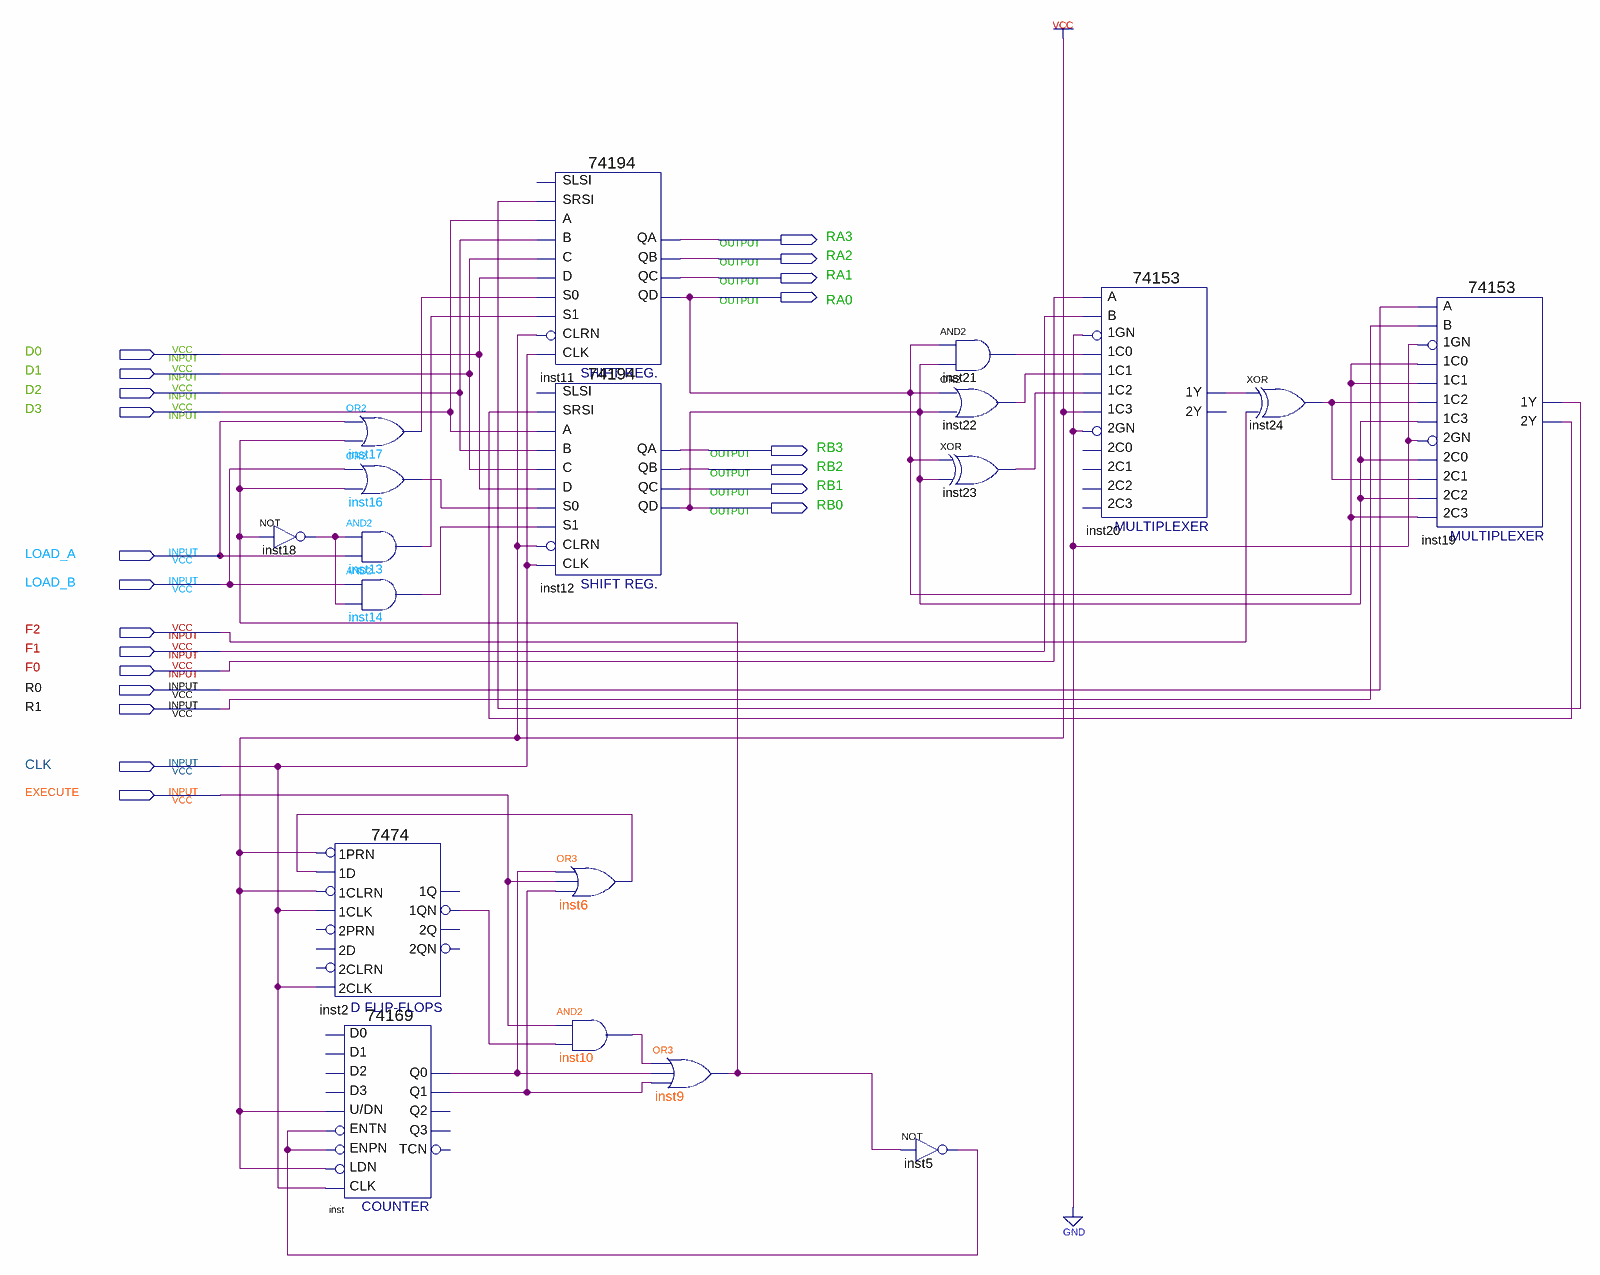
[diagram p0: schematic sheet]
// Quartus schematic Lab3.bdf as structural Verilog: 19 symbols, 21 pins
module Lab3 (
  input  D0,
  input  D1,
  input  D2,
  input  D3,
  input  LOAD_A,
  input  LOAD_B,
  input  F2,
  input  F1,
  input  F0,
  input  R0,
  input  R1,
  input  CLK,
  input  EXECUTE,
  output RA3,
  output RA2,
  output RA1,
  output RA0,
  output RB3,
  output RB2,
  output RB1,
  output RB0
);

  wire inst2_1qn, inst5_out, inst6_out, inst9_out, inst10_out, inst13_out, inst14_out, inst16_out,
       inst17_out, inst18_out, inst19_1y, inst19_2y, inst20_1y, inst21_out, inst22_out, inst23_out,
       inst24_out, inst_q0, inst_q1;

  not inst18 (inst18_out, inst9_out);
  or inst17 (inst17_out, LOAD_A, inst9_out);
  or inst16 (inst16_out, LOAD_B, inst9_out);
  and inst13 (inst13_out, inst18_out, LOAD_A);
  and inst14 (inst14_out, LOAD_B, inst18_out);
  \7474  inst2 (
    .\1CLK (CLK), .\1D (inst6_out), .\1PRN (1'b1), .\2CLK (CLK), .\1CLRN (1'b1), .\1QN (inst2_1qn));  // open: 2D, 2PRN, 2CLRN, 2Q, 2QN, 1Q
  \74169  inst (
    .ENTN(inst5_out), .\U/DN (1'b1), .LDN(1'b1), .CLK(CLK), .ENPN(inst5_out), .Q1(inst_q1), .Q0(inst_q0));  // open: D1, D2, D0, D3, Q2, TCN, Q3
  \74194  inst11 (
    .SRSI(inst19_1y), .B(D2), .C(D1), .CLK(CLK), .CLRN(1'b1), .D(D0), .S1(inst13_out), .S0(inst17_out),
    .A(D3), .QA(RA3), .QB(RA2), .QC(RA1), .QD(RA0));  // open: SLSI
  \74194  inst12 (
    .SRSI(inst19_2y), .B(D2), .C(D1), .CLK(CLK), .CLRN(1'b1), .D(D0), .S1(inst14_out), .S0(inst16_out),
    .A(D3), .QA(RB3), .QB(RB2), .QC(RB1), .QD(RB0));  // open: SLSI
  or inst6 (inst6_out, inst_q0, EXECUTE, inst_q1);
  and inst10 (inst10_out, EXECUTE, inst2_1qn);
  or inst9 (inst9_out, inst10_out, inst_q0, inst_q1);
  and inst21 (inst21_out, RA0, RB0);
  or inst22 (inst22_out, RA0, RB0);
  xor inst23 (inst23_out, RA0, RB0);
  not inst5 (inst5_out, inst9_out);
  \74153  inst20 (
    .\1C1 (inst22_out), .\1GN (1'b0), .\1C0 (inst21_out), .\2GN (1'b0), .\1C2 (inst23_out), .\1C3 (1'b1),
    .B(F1), .A(F0), .\1Y (inst20_1y));  // open: 2C0, 2C2, 2C1, 2C3, 2Y
  xor inst24 (inst24_out, inst20_1y, F2);
  \74153  inst19 (
    .\1C1 (RA0), .\1GN (1'b0), .\1C0 (RA0), .\2C0 (RB0), .\2GN (1'b0), .\2C2 (RB0), .\1C2 (inst24_out),
    .\1C3 (RB0), .B(R1), .A(R0), .\2C1 (inst24_out), .\2C3 (RA0), .\1Y (inst19_1y), .\2Y (inst19_2y));
endmodule
